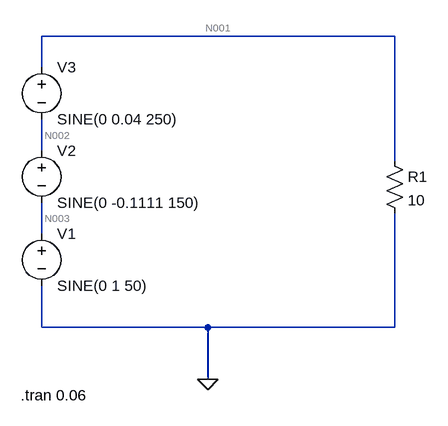
[diagram p0: schematic Triangle.asc]
Triangle.asc, the LTspice schematic file:
Version 4
SHEET 1 880 680
WIRE 208 -320 -336 -320
WIRE -336 -272 -336 -320
WIRE -336 -144 -336 -192
WIRE 208 -128 208 -320
WIRE -336 -16 -336 -64
WIRE -336 128 -336 64
WIRE -80 128 -336 128
WIRE 208 128 208 -48
WIRE 208 128 -80 128
WIRE -80 208 -80 128
FLAG -80 208 0
SYMBOL voltage -336 -32 R0
WINDOW 123 0 0 Left 0
WINDOW 39 0 0 Left 0
SYMATTR InstName V1
SYMATTR Value SINE(0 1 50)
SYMBOL voltage -336 -160 R0
WINDOW 123 0 0 Left 0
WINDOW 39 0 0 Left 0
SYMATTR InstName V2
SYMATTR Value SINE(0 -0.1111 150)
SYMBOL voltage -336 -288 R0
WINDOW 123 0 0 Left 0
WINDOW 39 0 0 Left 0
SYMATTR InstName V3
SYMATTR Value SINE(0 0.04 250)
SYMBOL res 192 -144 R0
SYMATTR InstName R1
SYMATTR Value 10
TEXT -368 232 Left 2 !.tran 0.06

The netlist it stands for:
* Triangle.asc
V1 N003 0 SINE(0 1 50)
V2 N002 N003 SINE(0 -0.1111 150)
V3 N001 N002 SINE(0 0.04 250)
R1 N001 0 10
.tran 0.06
.backanno
.end

* Results of the author's LTspice run, read from the files saved beside the schematic
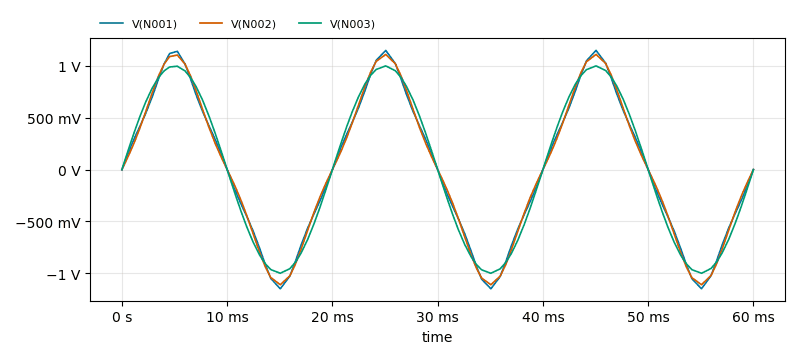
[diagram p1: Transient Analysis of Triangle.asc, plotted from the saved traces]
* Transient Analysis, 1 run:
*   V(N001): min -1.149 V, max 1.149 V, average 158.7 µV, rms 709.2 mV, last 0 V
*   V(N002): min -1.11 V, max 1.11 V, average 146.8 µV, rms 709.5 mV, last 0 V
*   V(N003): min -999.8 mV, max 999.8 mV, average 44.94 µV, rms 705.8 mV, last 0 V